# EAGLE schematic driver_piezo (EAGLE 7.1.0)
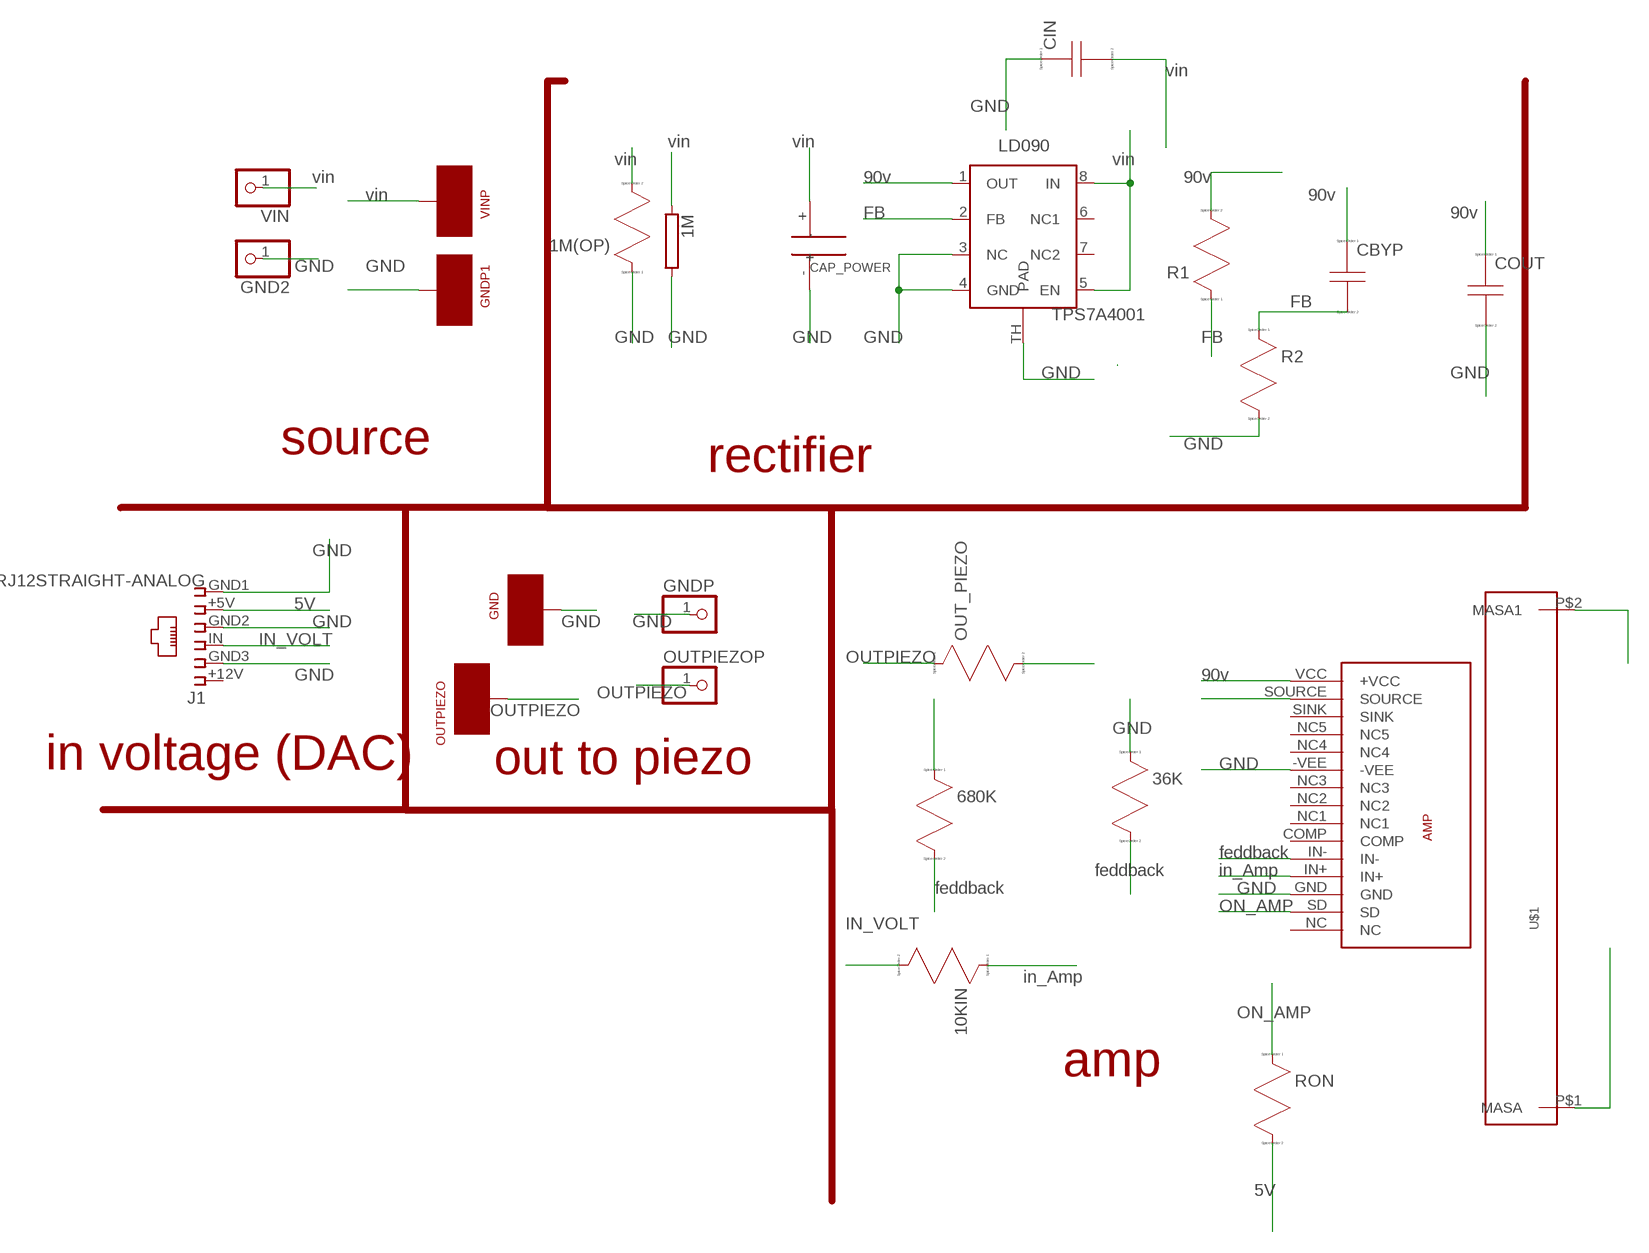
[diagram p0: schematic, sheet 1]

## Parts
1M  RCA0002  [CA0002]
1M(OP)  RES  [R0805]
10KIN  RES  [R0805]
36K  RES  [R0805]
680K  RES  [R0805]
AMP  POWER_AMP_LME49811TB  [POWER_AMP_LME49811TB]
CAP_POWER  CAP200VCAP200V  [CAP200V]
CBYP  CAP  [C0805]
CIN  CAP  [C0805]
COUT  CAP  [C0805]
GND  PAD  [PAD]
GND2  PINHD-1X1  [1X01]
GNDP  PINHD-1X1  [1X01]
GNDP1  PAD  [PAD]
J1  RJ12STRAIGHT-ANALOG  [RJ12-STRAIGHT-ANALOG]
LD090  TPS7A4001  [S-PDSO-G08]
OUT_PIEZO  RES  [R0805]
OUTPIEZO  PAD  [PAD]
OUTPIEZOP  PINHD-1X1  [1X01]
R1  RES  [R0805]
R2  RES  [R0805]
RON  RES  [R0805]
U$1  DISIPADOR  [DISIPADOR]
VIN  PINHD-1X1  [1X01]
VINP  PAD  [PAD]

## Nets
5V [5V]: J1.+5V RON.2(B)
B: 36K.2(B) 680K.2(B) AMP.IN-
FB: CBYP.2(B) LD090.2(FB) R1.1(A) R2.1(A)
GND [GND]: 1M(OP).1(A) 1M.2 36K.1(A) AMP.-VEE AMP.GND CAP_POWER.- CIN.1(A) COUT.2(B) GND2.1 GND.P$1 GNDP1.P$1 GNDP.1 J1.GND1 J1.GND2 J1.GND3 LD090.3(NC) LD090.4(GND) LD090.TH(PAD) R2.2(B) U$1.P$1(MASA) U$1.P$2(MASA1)
IN_AMP: 10KIN.1(A) AMP.IN+
IN_VOLTAGE: 10KIN.2(B) J1.IN
ON: AMP.SD RON.1(A)
OUT_PIEZO: OUT_PIEZO.1(A) OUTPIEZO.P$1 OUTPIEZOP.1
SOURCE: 680K.1(A) AMP.SOURCE OUT_PIEZO.2(B)
V90 [PWR]: AMP.VCC(+VCC) CBYP.1(A) COUT.1(A) LD090.1(OUT) R1.2(B)
VIN [VIN]: 1M(OP).2(B) 1M.1 CAP_POWER.+ CIN.2(B) LD090.5(EN) LD090.8(IN) VIN.1 VINP.P$1
Unconnected: AMP.COMP AMP.NC AMP.NC1 AMP.NC2 AMP.NC3 AMP.NC4 AMP.NC5 AMP.SINK J1.+12V LD090.6(NC1) LD090.7(NC2)

## Notes on the sheet
- vin
- GND
- vin | vin
- vin | vin
- vin | 90v | 90v
- vin | 90v
- FB | 90v
- GND | GND
- FB
- GND | GND | GND | GND | FB
- GND | GND
- source | GND
- rectifier
- GND
- 5V
- GND | GND | GND
- IN_VOLT
- OUTPIEZO
- GND | 90v
- OUTPIEZO
- OUTPIEZO
- GND
- in voltage (DAC) | out to piezo | GND
- feddback
- feddback | in_Amp
- feddback | GND
- ON_AMP
- IN_VOLT
- in_Amp
- ON_AMP
- amp
- 5V

## Library data of the parts
1M = resistor-power:R: Power Resitor; OC_FARNELL: unknown; OC_NEWARK: unknown
1M(OP) 10KIN 36K 680K OUT_PIEZO R1 R2 RON = sym:RES: A resistor
AMP = PIEZO_LBR:POWER_AMP_LME49811TB
CAP_POWER = PIEZO_LBR:CAP200V
CBYP CIN COUT = sym:CAP: Capacitor
GND GNDP1 OUTPIEZO VINP = PIEZO_LBR:PAD
GND2 GNDP OUTPIEZOP VIN = pinhead:PINHD-1X1: PIN HEADER
J1 = lpatiny:RJ12: CORCOM Modular RJ Jacks No Shield Source: www.tycoelectronics.com .. ENG_DS_1654001_1099_RJ_L_0507.pdf
LD090 = PIEZO_LBR:TPS7A4001
U$1 = PIEZO_LBR:DISIPADOR

## Net classes
1 PWR: width 0.127 mm, clearance 0.406 mm
2 GND: width 0.127 mm, clearance 0.762 mm
3 VIN: width 0.127 mm, clearance 0.406 mm
4 5V: width 0.406 mm, clearance 0.61 mm